# Altium schematic sheet Differential_Amplification.SchDoc
size A
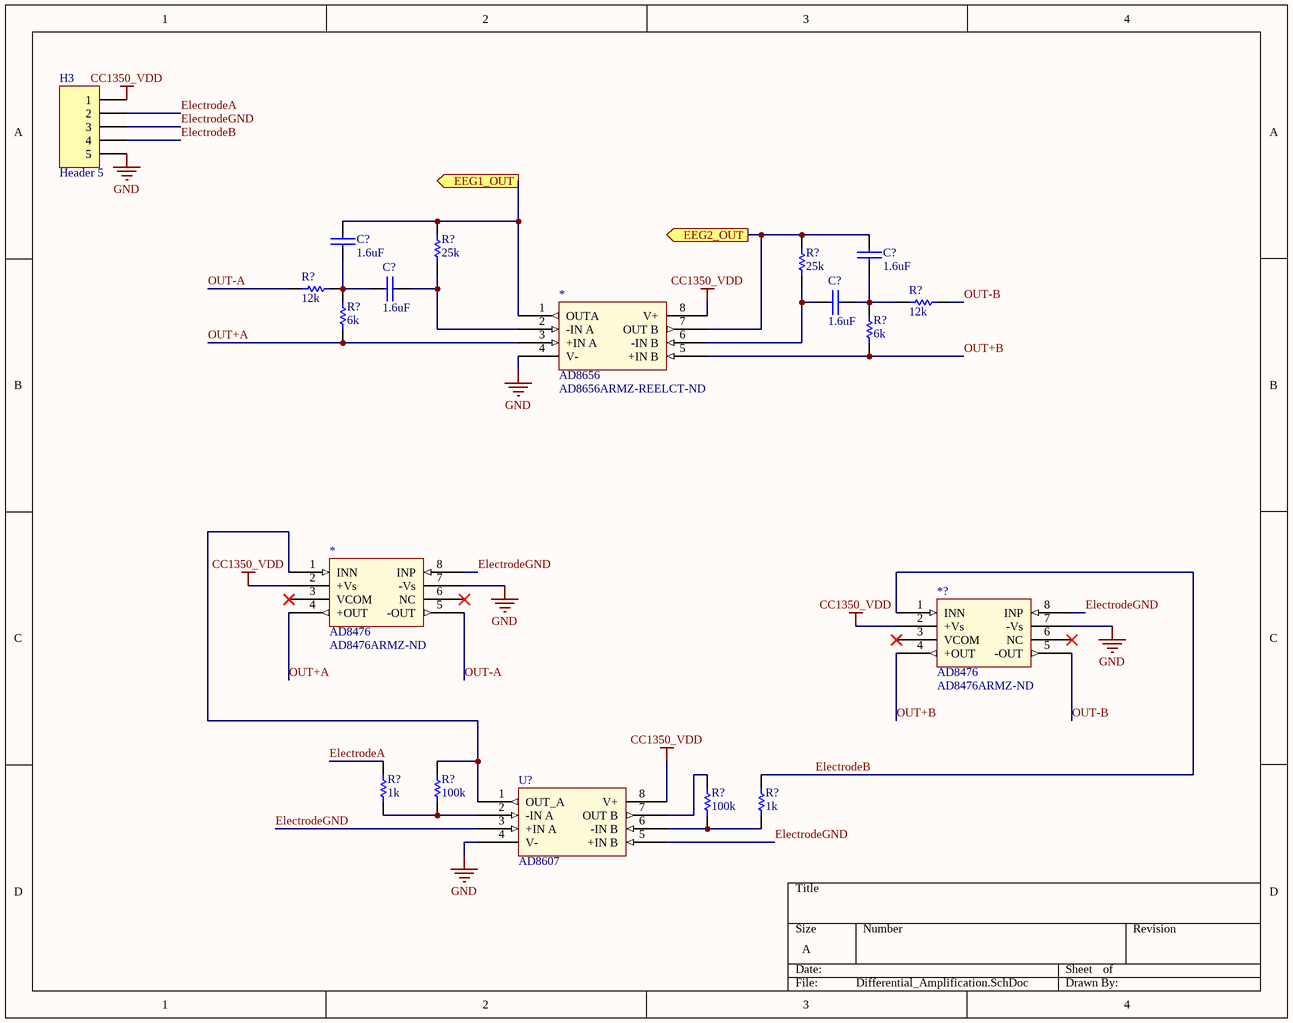
[diagram p0: Differential_Amplification.SchDoc]

## Parts
(Parts that share a designator on the sheet are numbered #1, #2 ... from top to bottom, then left to right.)
*#1  AD8656  Supplier Part Number 1: AD8656ARMZ-REELCT-ND  [MSOP-8]
*#2  AD8476  Supplier Part Number 1: AD8476ARMZ-ND  [MSOP-8]
*?  AD8476  Supplier Part Number 1: AD8476ARMZ-ND  [MSOP-8]
C?#1  1.6uF  [0402[IMP]]
C?#2  1.6uF  [0402[IMP]]
C?#3  1.6uF  [0402[IMP]]
C?#4  1.6uF  [0402[IMP]]
H3  Header 5  [Header 5  -MolexPicoBlade - RightAngle]
R?#1  25k  [0402[IMP]]
R?#2  25k  [0402[IMP]]
R?#3  12k  [0402[IMP]]
R?#4  6k  [0402[IMP]]
R?#5  6k  [0402[IMP]]
R?#6  12k  [0402[IMP]]
R?#7  1k  [0402[IMP]]
R?#8  100k  [0402[IMP]]
R?#9  100k  [0402[IMP]]
R?#10  1k  [0402[IMP]]
U?  AD8607  [MSOP-8]

## Ports
EEG1_OUT (out), EEG2_OUT (out)

## Nets
CC1350_VDD: *#1.8(V+) *#2.2(+Vs) *?.2(+Vs) H3.1 U?.8(V+)
GND: *#1.4(V-) *#2.7(-Vs) *?.7(-Vs) H3.5 U?.4(V-)
EEG1_OUT: *#1.1(OUTA) C?#1.2 R?#1.1 ; port EEG1_OUT
EEG2_OUT: *#1.7(OUT_B) C?#2.2 R?#2.1 ; port EEG2_OUT
ElectrodeA: H3.2 R?#7.2
ElectrodeB: *?.1(INN) H3.4 R?#10.2
ElectrodeGND: *#2.8(INP) *?.8(INP) H3.3 U?.3(+IN_A) U?.5(+IN_B)
OUT+A: *#1.3(+IN_A) *#2.4(+OUT) R?#4.2
OUT+B: *#1.5(+IN_B) *?.4(+OUT) R?#5.2
OUT-A: *#2.5(-OUT) R?#3.2
OUT-B: *?.5(-OUT) R?#6.1
Net*#1_2: *#1.2(-IN_A) C?#3.2 R?#1.2
Net*#1_6: *#1.6(-IN_B) C?#4.1 R?#2.2
Net*#2_1: *#2.1(INN) R?#8.2 U?.1(OUT_A)
NetC?#1_1: C?#1.1 C?#3.1 R?#3.1 R?#4.1
NetC?#2_1: C?#2.1 C?#4.2 R?#5.1 R?#6.2
NetR?#7_1: R?#7.1 R?#8.1 U?.2(-IN_A)
NetR?#9_1: R?#9.1 R?#10.1 U?.6(-IN_B)
NetR?#9_2: R?#9.2 U?.7(OUT_B)

Not connected (* = marked no-connect by the designer): *#2 3(VCOM)* 6(NC)*; *? 3(VCOM)* 6(NC)*

## Library data of the parts
C?#1-C?#4 = CAPACITOR: VOLTAGE: CMAX; CURRENT: CIMAX; KNEE: CBMAX; PSpiceTemplate: C^@REFDES %1 %2 ?TOLERANCE|C^@REFDES| @VALUE ?IC/IC=@IC/ TC=@TC1,@TC2 ?TOLERANCE|\n.model C^@REFDES CAP C=1 DEV=@TOLERANCE%|; DIST: FLAT; SLOPE: CSMAX; MAX_TEMP: CTMAX; TC1: 0; CLASS: DISCRETE; TC2: 0; Value: 1.6uF; Supplier 1: Digi-Key; Supplier Part Number 1: 399-1013-1-ND
R?#1-R?#10 = RESISTOR: Supplier 1: Digi-Key; Supplier Part Number 1: 311-180JRCT-ND
  R?#1 R?#2: Value: 25k
  R?#3 R?#6: Value: 12k
  R?#4 R?#5: Value: 6k
  R?#7 R?#10: Value: 1k
  R?#8 R?#9: Value: 100k
*#1 = AD8656: Supplier 1: Digi-Key
*#2 *? = AD8476: Supplier 1: Digi-Key
H3 = Header 5: Supplier 1: Digi-Key; Supplier Part Number 1: WM7623CT-ND
U? = AD8607: Supplier 1: Digi-Key; Supplier Part Number 1: AD8607ARMZ-R2CT-ND